# EAGLE schematic EEZ XMOS eval r1B4 (EAGLE 6.1)
Assembly variants: Farnell, TME

## Sheet 1 of 5
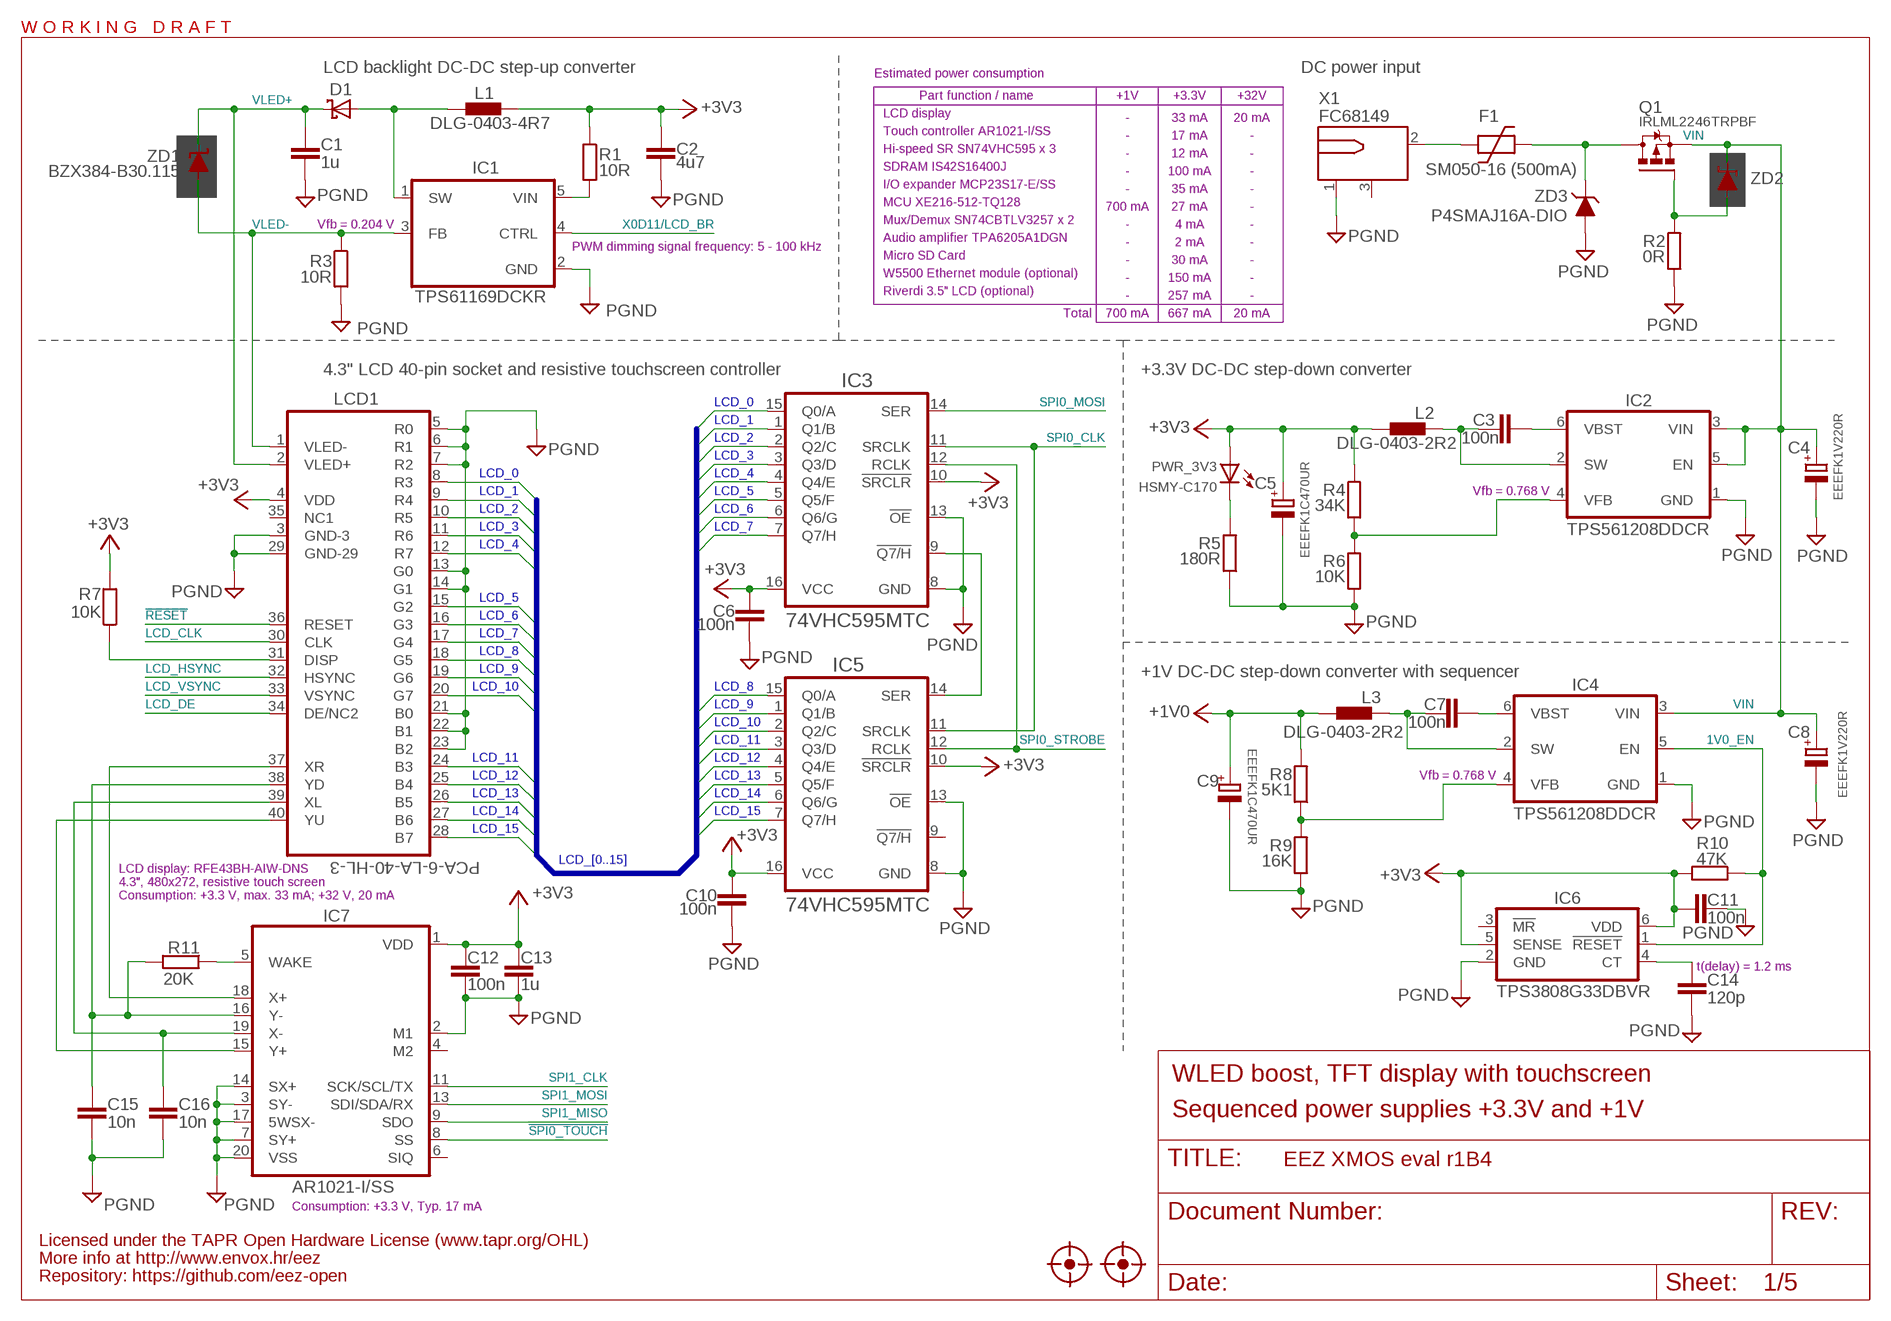
[diagram p0: schematic, sheet 1]

### Parts
C1  1u  C-EUC0805  [C0805]
C2  4u7  C-EUC1206  [C1206]
C3  100n  C-EUC0603  [C0603]
C4  EEEFK1V220R  EEE-FK1V100R-CASE-C  [CAPAE530X610N]
C5  EEEFK1C470UR  EEE-FK1V100R-CASE-C  [CAPAE530X610N]
C6  100n  C-EUC0603  [C0603]
C7  100n  C-EUC0603  [C0603]
C8  EEEFK1V220R  EEE-FK1V100R-CASE-C  [CAPAE530X610N]
C9  EEEFK1C470UR  EEE-FK1V100R-CASE-C  [CAPAE530X610N]
C10  100n  C-EUC0603  [C0603]
C11  100n  C-EUC0603  [C0603]
C12  100n  C-EUC0603  [C0603]
C13  1u  C-EUC0805  [C0805]
C14  120p  C-EUC0805  [C0805]
C15  10n  C-EUC0805  [C0805]
C16  10n  C-EUC0805  [C0805]
D1  SCHOTTKYSOD123  [SOD123]
F1  SM050-16 (500mA)  FUSE_RESETTABLE21210  [F1210]
FM1  FIDUCIAL_2  [FIDUCIAL_DUAL]
FM2  FIDUCIAL_2  [FIDUCIAL_DUAL]
IC1  TPS61169DCKR  [DCK0005A_N]
IC2  TPS561208DDCR  TPS56120X  [DBV6]
IC3  74VHC595MTC  SN74HC595TSSOP  [PW(R-PDSO-G16)]
IC4  TPS561208DDCR  TPS56120X  [DBV6]
IC5  74VHC595MTC  SN74HC595TSSOP  [PW(R-PDSO-G16)]
IC6  TPS3808G33DBVR  TPS3808  [DBV6]
IC7  AR1021-I/SS  [SOP65P780X200-20N]
L1  DLG-0403-4R7  DE0403  [DE0403]
L2  DLG-0403-2R2  DE0403  [DE0403]
L3  DLG-0403-2R2  DE0403  [DE0403]
LCD1  PCA-6-LA-40-HL-3  RFE430Y-AIW-DNS  [FPC_40]
PWR_3V3  HSMY-C170  LED0805  [LED_0805]
Q1  IRLML2246TRPBF  [SOT95P237X112-3N]
R1  10R  R-EU_R1206  [R1206]
R2  0R  R-EU_R0805  [R0805]
R3  10R  R-EU_R1206  [R1206]
R4  34K  R-EU_R0805  [R0805]
R5  180R  R-EU_R0805  [R0805]
R6  10K  R-EU_R0805  [R0805]
R7  10K  R-EU_R0805  [R0805]
R8  5K1  R-EU_R0805  [R0805]
R9  16K  R-EU_R0805  [R0805]
R10  47K  R-EU_R0805  [R0805]
R11  20K  R-EU_R0805  [R0805]
X1  FC68149  DC21_PWRX  [DC-21MM]
ZD1  BZX384-B30.115  ZENER-DIODESOD323  [SOD323-W]
ZD2  ZENER-DIODESOD323  [SOD323-W]
ZD3  P4SMAJ16A-DIO  PSMAXX  [DO214AC]

### Nets
1V0_EN: IC4.5(EN) IC6.1(!RESET) R10.1
!RESET: LCD1.36(RESET) ; also sheet 2,3,5
!SPI0_TOUCH: IC7.8(SS) ; also sheet 3
+1V0: C9.1 L3.2 R8.2 ; also sheet 2,3
+1V0_SW: C7.1 IC4.2(SW) L3.1
+3V3: C2.1 C5.1 C6.2 C10.2 C11.2 C12.2 C13.2 IC3.10(!SRCLR) IC3.16(VCC) IC5.10(!SRCLR) IC5.16(VCC) IC6.5(SENSE) IC6.6(VDD) IC7.1(VDD) L1.1 L2.2 LCD1.4(VDD) PWR_3V3.A R1.1 R4.2 R7.2 R10.2 ; also sheet 2,3,4,5
+3V3_SW: C3.1 IC2.2(SW) L2.1
GND [gnd]: C1.2 C2.2 C4.2 C5.2 C6.1 C8.2 C9.2 C10.1 C11.1 C12.1 C13.1 C14.2 C15.2 C16.2 IC1.2(GND) IC2.1(GND) IC3.8(GND) IC3.13(!OE) IC4.1(GND) IC5.8(GND) IC5.13(!OE) IC6.2(GND) IC7.2(M1) IC7.3(SY-) IC7.7(SY+) IC7.14(SX+) IC7.17(5WSX-) IC7.20(VSS) LCD1.3(GND-3) LCD1.5(R0) LCD1.6(R1) LCD1.7(R2) LCD1.13(G0) LCD1.14(G1) LCD1.21(B0) LCD1.22(B1) LCD1.23(B2) LCD1.29(GND-29) R2.1 R3.2 R5.1 R6.1 R9.1 X1.1 ZD3.A ; supply symbol labelled PGND ; also sheet 2,3,4,5
LCD_0: IC3.15(Q0/A) LCD1.8(R3)
LCD_1: IC3.1(Q1/B) LCD1.9(R4)
LCD_2: IC3.2(Q2/C) LCD1.10(R5)
LCD_3: IC3.3(Q3/D) LCD1.11(R6)
LCD_4: IC3.4(Q4/E) LCD1.12(R7)
LCD_5: IC3.5(Q5/F) LCD1.15(G2)
LCD_6: IC3.6(Q6/G) LCD1.16(G3)
LCD_7: IC3.7(Q7/H) LCD1.17(G4)
LCD_8: IC5.15(Q0/A) LCD1.18(G5)
LCD_9: IC5.1(Q1/B) LCD1.19(G6)
LCD_10: IC5.2(Q2/C) LCD1.20(G7)
LCD_11: IC5.3(Q3/D) LCD1.24(B3)
LCD_12: IC5.4(Q4/E) LCD1.25(B4)
LCD_13: IC5.5(Q5/F) LCD1.26(B5)
LCD_14: IC5.6(Q6/G) LCD1.27(B6)
LCD_15: IC5.7(Q7/H) LCD1.28(B7)
LCD_CLK: LCD1.30(CLK) ; also sheet 3
LCD_DE: LCD1.34(DE/NC2) ; also sheet 3
LCD_HSYNC: LCD1.32(HSYNC) ; also sheet 3
LCD_VSYNC: LCD1.33(VSYNC) ; also sheet 3
N$1: PWR_3V3.C R5.2
N$2: IC7.15(Y+) LCD1.40(YU)
N$3: C16.1 IC7.19(X-) LCD1.39(XL)
N$4: C15.1 IC7.16(Y-) LCD1.38(YD) R11.2
N$5: IC7.18(X+) LCD1.37(XR)
N$7: Q1.1(G) R2.2 ZD2.A
N$8: IC7.5(WAKE) R11.1
N$15: F1.1 X1.2
N$28: IC2.4(VFB) R4.1 R6.2
N$30: IC1.5(VIN) R1.2
N$33: C3.2 IC2.6(VBST)
N$40: IC3.9(!Q7/H) IC5.14(SER)
N$46: IC4.4(VFB) R8.1 R9.2
N$49: C7.2 IC4.6(VBST)
N$63: C14.1 IC6.4(CT)
N$79: LCD1.31(DISP) R7.1
PMOS_D: F1.2 Q1.3(D) ZD3.C
SPI0_CLK: IC3.11(SRCLK) IC5.11(SRCLK) ; also sheet 3
SPI0_MOSI: IC3.14(SER) ; also sheet 3
SPI0_STROBE: IC3.12(RCLK) IC5.12(RCLK) ; also sheet 3
SPI1_CLK: IC7.11(SCK/SCL/TX) ; also sheet 3,5
SPI1_MISO: IC7.9(SDO) ; also sheet 3,5
SPI1_MOSI: IC7.13(SDI/SDA/RX) ; also sheet 3,5
SW_WLED: D1.A IC1.1(SW) L1.2
VIN: C4.1 C8.1 IC2.3(VIN) IC2.5(EN) IC4.3(VIN) Q1.2(S) ZD2.C ; also sheet 3
VLED+: C1.1 D1.C LCD1.2(VLED+) ZD1.C
VLED-: IC1.3(FB) LCD1.1(VLED-) R3.1 ZD1.A
X0D11/LCD_BR: IC1.4(CTRL) ; also sheet 2,3
Unconnected: IC5.9(!Q7/H) IC6.3(!MR) IC7.4(M2) IC7.6(SIQ) LCD1.35(NC1)

### Buses
LCD_[0..15]

### Notes on the sheet
- W O R K I N G   D R A F T
- LCD backlight DC-DC step-up converter | DC power input
- Estimated power consumption
- Part function / name | +1V | +3.3V | +32V
- LCD display | - | 33 mA | 20 mA
- Touch controller AR1021-I/SS | - | 17 mA | -
- Hi-speed SR SN74VHC595 x 3 | - | 12 mA | -
- SDRAM IS42S16400J | - | 100 mA | -
- I/O expander MCP23S17-E/SS | - | 35 mA | -
- MCU XE216-512-TQ128 | 700 mA | 27 mA | -
- Mux/Demux SN74CBTLV3257 x 2 | - | 4 mA | -
- Vfb = 0.204 V
- Audio amplifier TPA6205A1DGN | - | 2 mA | -
- PWM dimming signal frequency: 5 - 100 kHz
- Micro SD Card | - | 30 mA | -
- W5500 Ethernet module (optional) | - | 150 mA | -
- Riverdi 3.5" LCD (optional) | - | 257 mA | -
- 700 mA | 667 mA | 20 mA
- Total
- 4.3" LCD 40-pin socket and resistive touchscreen controller | +3.3V DC-DC step-down converter
- Vfb = 0.768 V
- +1V DC-DC step-down converter with sequencer
- Vfb = 0.768 V
- LCD display: RFE43BH-AIW-DNS
- 4.3", 480x272, resistive touch screen
- Consumption: +3.3 V, max. 33 mA; +32 V, 20 mA
- t(delay) = 1.2 ms
- WLED boost, TFT display with touchscreen
- Sequenced power supplies +3.3V and +1V
- Consumption: +3.3 V, Typ. 17 mA
- Licensed under the TAPR Open Hardware License (www.tapr.org/OHL)
- More info at http://www.envox.hr/eez
- Repository: https://github.com/eez-open

## Sheet 2 of 5
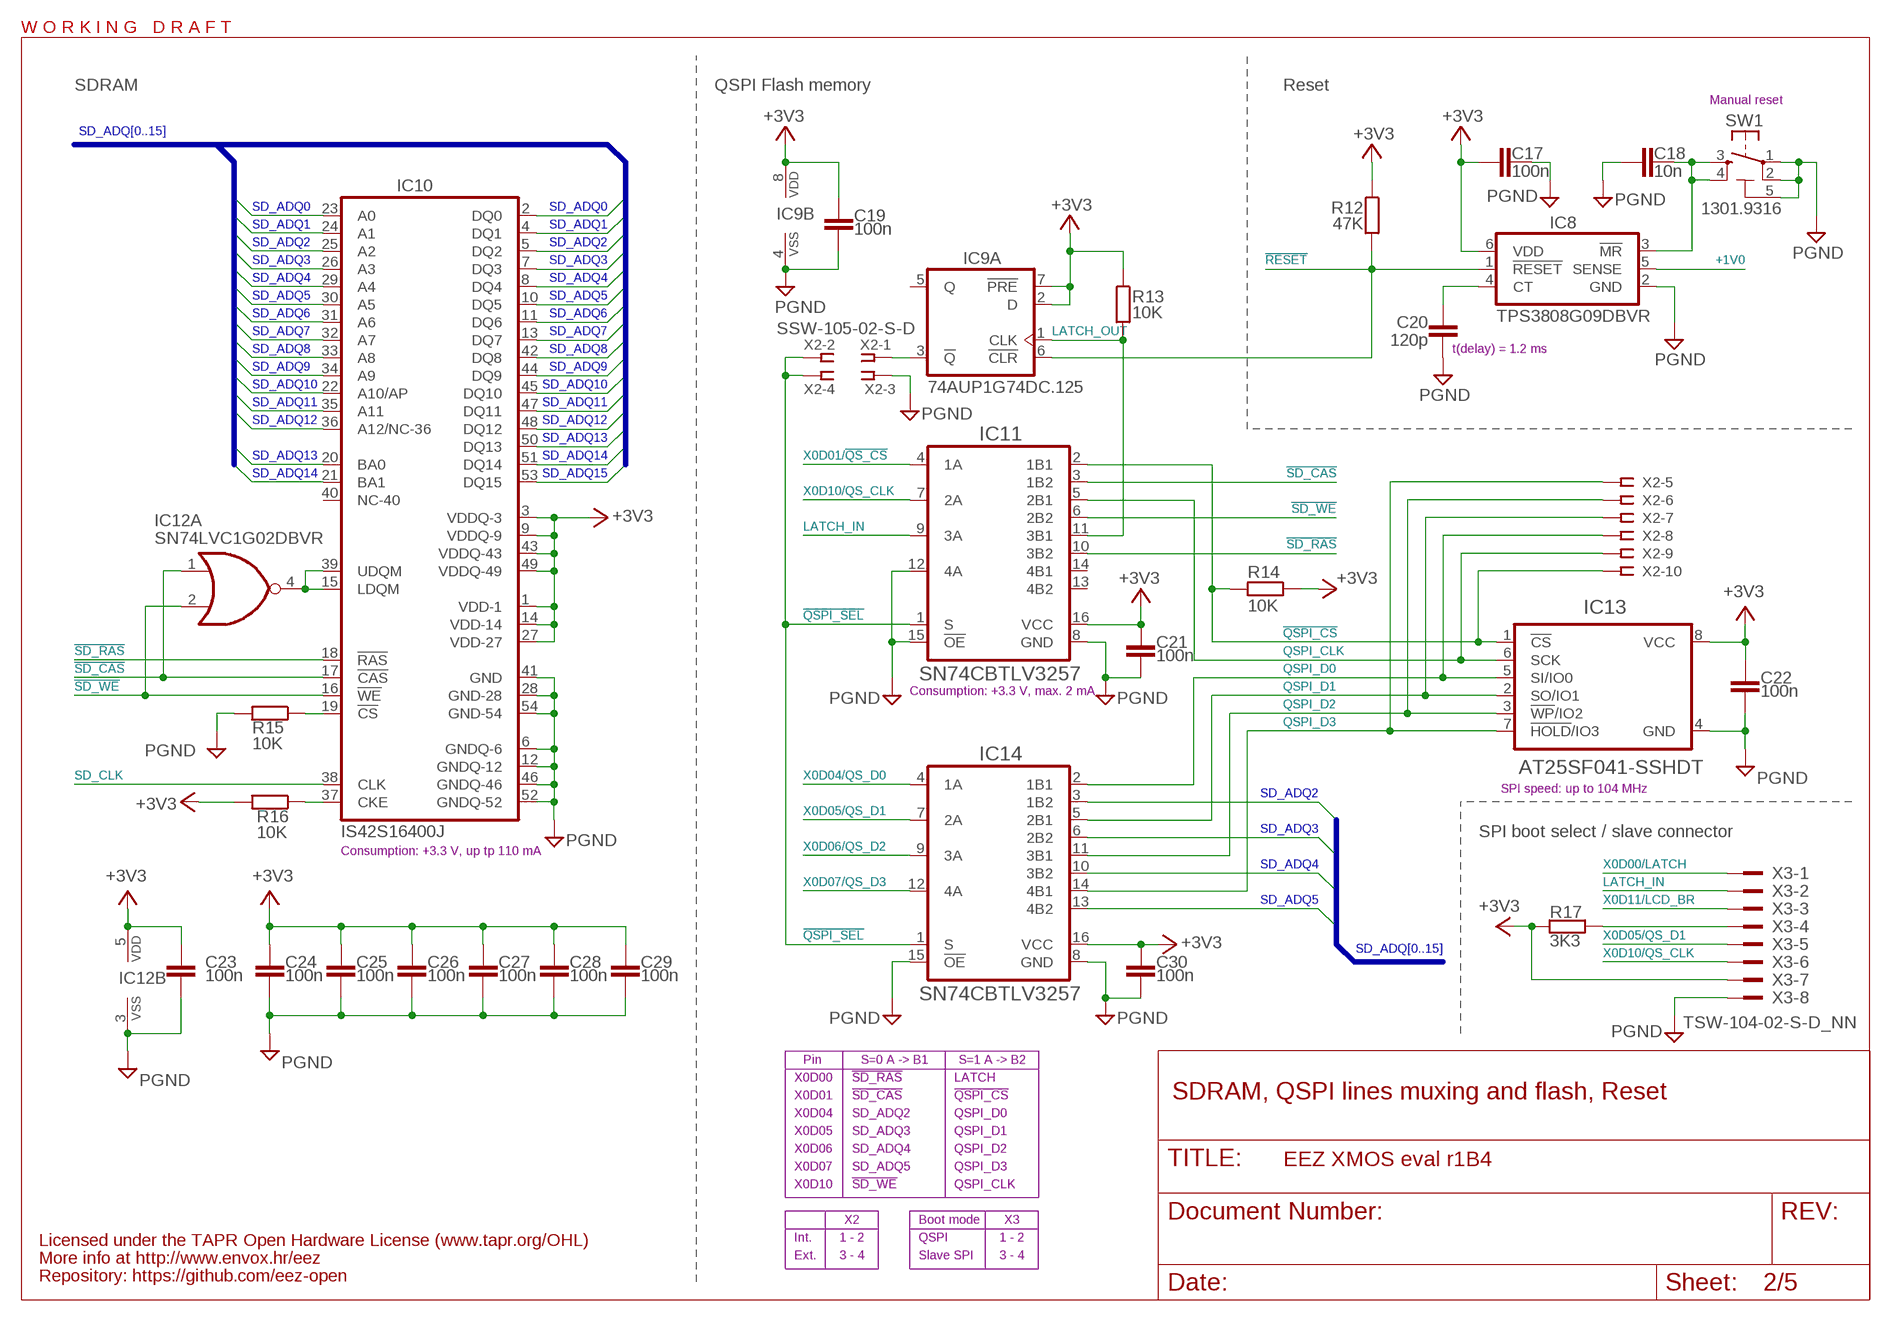
[diagram p1: schematic, sheet 2]

### Parts
C17  100n  C-EUC0603  [C0603]
C18  10n  C-EUC0805  [C0805]
C19  100n  C-EUC0603  [C0603]
C20  120p  C-EUC0805  [C0805]
C21  100n  C-EUC0603  [C0603]
C22  100n  C-EUC0603  [C0603]
C23  100n  C-EUC0603  [C0603]
C24  100n  C-EUC0603  [C0603]
C25  100n  C-EUC0603  [C0603]
C26  100n  C-EUC0603  [C0603]
C27  100n  C-EUC0603  [C0603]
C28  100n  C-EUC0603  [C0603]
C29  100n  C-EUC0603  [C0603]
C30  100n  C-EUC0603  [C0603]
IC8  TPS3808G09DBVR  TPS3808  [DBV6]
IC9  74AUP1G74DC.125  SN74LVC1G74DCTR-VSSOP  [DCU8]
IC10  IS42S16400J  IS42S16400  [TSOPII-54]
IC11  SN74CBTLV3257  [PW(R-PDSO-G16)]
IC12  SN74LVC1G02DBVR  [DBV5]
IC13  AT25SF041-SSHDT  AT25SFXXX  [SOIC127P600X175-8N]
IC14  SN74CBTLV3257  [PW(R-PDSO-G16)]
R12  47K  R-EU_R0805  [R0805]
R13  10K  R-EU_R1206  [R1206]
R14  10K  R-EU_R0805  [R0805]
R15  10K  R-EU_R0805  [R0805]
R16  10K  R-EU_R0805  [R0805]
R17  3K3  R-EU_R0805  [R0805]
SW1  1301.9316  TACT_SW  [TACTM-6XN]
X2  SSW-105-02-S-D  [SSW-105-02-S-D]
X3  TSW-104-02-S-D_NN  [TSW-104-02-S-D-NONUM]

### Nets
!QSPI_CS: IC11.2(1B1) IC13.1(!CS) R14.2 X2.10
!QSPI_SEL: IC11.1(S) IC14.1(S) X2.2 X2.4
!RESET: IC8.1(!RESET) IC9.6(A:!CLR) R12.2 ; also sheet 1,3,5
!SD_CAS: IC10.17(!CAS) IC11.3(1B2) IC12.1(A:A)
!SD_RAS: IC10.18(!RAS) IC11.10(3B2)
!SD_WE: IC10.16(!WE) IC11.6(2B2) IC12.2(A:B)
+1V0: IC8.5(SENSE) ; also sheet 1,3
+3V3: C17.1 C19.1 C21.1 C22.1 C23.1 C24.1 C25.1 C26.1 C27.1 C28.1 C29.1 C30.1 IC8.6(VDD) IC9.2(A:D) IC9.7(A:!PRE) IC9.8(B:VDD) IC10.1(VDD-1) IC10.3(VDDQ-3) IC10.9(VDDQ-9) IC10.14(VDD-14) IC10.27(VDD-27) IC10.43(VDDQ-43) IC10.49(VDDQ-49) IC11.16(VCC) IC12.5(B:VDD) IC13.8(VCC) IC14.16(VCC) R12.1 R13.1 R14.1 R16.2 R17.2 X3.7 ; also sheet 1,3,4,5
GND [gnd]: C17.2 C18.1 C19.2 C20.2 C21.2 C22.2 C23.2 C24.2 C25.2 C26.2 C27.2 C28.2 C29.2 C30.2 IC8.2(GND) IC9.4(B:VSS) IC10.6(GNDQ-6) IC10.12(GNDQ-12) IC10.28(GND-28) IC10.41(GND) IC10.46(GNDQ-46) IC10.52(GNDQ-52) IC10.54(GND-54) IC11.8(GND) IC11.12(4A) IC11.15(!OE) IC12.3(B:VSS) IC13.4(GND) IC14.8(GND) IC14.15(!OE) R15.2 SW1.1 SW1.2 SW1.5(5-GND) X2.3 X3.8 ; supply symbol labelled PGND ; also sheet 1,3,4,5
LATCH_IN: IC11.9(3A) X3.2
LATCH_OUT: IC9.1(A:CLK) IC11.11(3B1) R13.2
N$14: R17.1 X3.4
N$20: IC10.19(!CS) R15.1
N$21: IC10.15(LDQM) IC10.39(UDQM) IC12.4(A:Y)
N$22: IC10.37(CKE) R16.1
N$31: C20.1 IC8.4(CT)
N$32: C18.2 IC8.3(!MR) SW1.3 SW1.4
N$35: IC9.3(A:!Q) X2.1
QSPI_CLK: IC11.5(2B1) IC13.6(SCK) X2.9
QSPI_D0: IC13.5(SI/IO0) IC14.2(1B1) X2.8
QSPI_D1: IC13.2(SO/IO1) IC14.5(2B1) X2.7
QSPI_D2: IC13.3(!WP!/IO2) IC14.11(3B1) X2.6
QSPI_D3: IC13.7(!HOLD!/IO3) IC14.14(4B1) X2.5
SD_ADQ0: IC10.2(DQ0) IC10.23(A0) ; also sheet 3
SD_ADQ1: IC10.4(DQ1) IC10.24(A1) ; also sheet 3
SD_ADQ2: IC10.5(DQ2) IC10.25(A2) IC14.3(1B2)
SD_ADQ3: IC10.7(DQ3) IC10.26(A3) IC14.6(2B2)
SD_ADQ4: IC10.8(DQ4) IC10.29(A4) IC14.10(3B2)
SD_ADQ5: IC10.10(DQ5) IC10.30(A5) IC14.13(4B2)
SD_ADQ6: IC10.11(DQ6) IC10.31(A6) ; also sheet 3
SD_ADQ7: IC10.13(DQ7) IC10.32(A7) ; also sheet 3
SD_ADQ8: IC10.33(A8) IC10.42(DQ8) ; also sheet 3
SD_ADQ9: IC10.34(A9) IC10.44(DQ9) ; also sheet 3
SD_ADQ10: IC10.22(A10/AP) IC10.45(DQ10) ; also sheet 3
SD_ADQ11: IC10.35(A11) IC10.47(DQ11) ; also sheet 3
SD_ADQ12: IC10.36(A12/NC-36) IC10.48(DQ12) ; also sheet 3
SD_ADQ13: IC10.20(BA0) IC10.50(DQ13) ; also sheet 3
SD_ADQ14: IC10.21(BA1) IC10.51(DQ14) ; also sheet 3
SD_ADQ15: IC10.53(DQ15) ; also sheet 3
SD_CLK: IC10.38(CLK) ; also sheet 3
X0D00/LATCH: X3.1 ; also sheet 3
X0D01/!QS_CS: IC11.4(1A) ; also sheet 3
X0D04/QS_D0: IC14.4(1A) ; also sheet 3
X0D05/QS_D1: IC14.7(2A) X3.5 ; also sheet 3
X0D06/QS_D2: IC14.9(3A) ; also sheet 3
X0D07/QS_D3: IC14.12(4A) ; also sheet 3
X0D10/QS_CLK: IC11.7(2A) X3.6 ; also sheet 3
X0D11/LCD_BR: X3.3 ; also sheet 1,3
Unconnected: IC9.5(A:Q) IC10.40(NC-40) IC11.13(4B2) IC11.14(4B1)

### Buses
SD_ADQ[0..15]

### Notes on the sheet
- W O R K I N G   D R A F T
- SDRAM | QSPI Flash memory | Reset
- Manual reset
- t(delay) = 1.2 ms
- Consumption: +3.3 V, max. 2 mA
- SPI speed: up to 104 MHz
- SPI boot select / slave connector
- Consumption: +3.3 V, up tp 110 mA
- Pin | S=0 A -> B1 | S=1 A -> B2
- X0D00 | !SD_RAS | LATCH
- X0D01 | !SD_CAS | !QSPI_CS | SDRAM, QSPI lines muxing and flash, Reset
- X0D04 | SD_ADQ2 | QSPI_D0
- X0D05 | SD_ADQ3 | QSPI_D1
- X0D06 | SD_ADQ4 | QSPI_D2
- X0D07 | SD_ADQ5 | QSPI_D3
- X0D10 | !SD_WE | QSPI_CLK
- X2 | Boot mode | X3
- Int. | 1 - 2 | QSPI | 1 - 2
- Licensed under the TAPR Open Hardware License (www.tapr.org/OHL)
- Ext. | 3 - 4 | Slave SPI | 3 - 4
- More info at http://www.envox.hr/eez
- Repository: https://github.com/eez-open

## Sheet 3 of 5
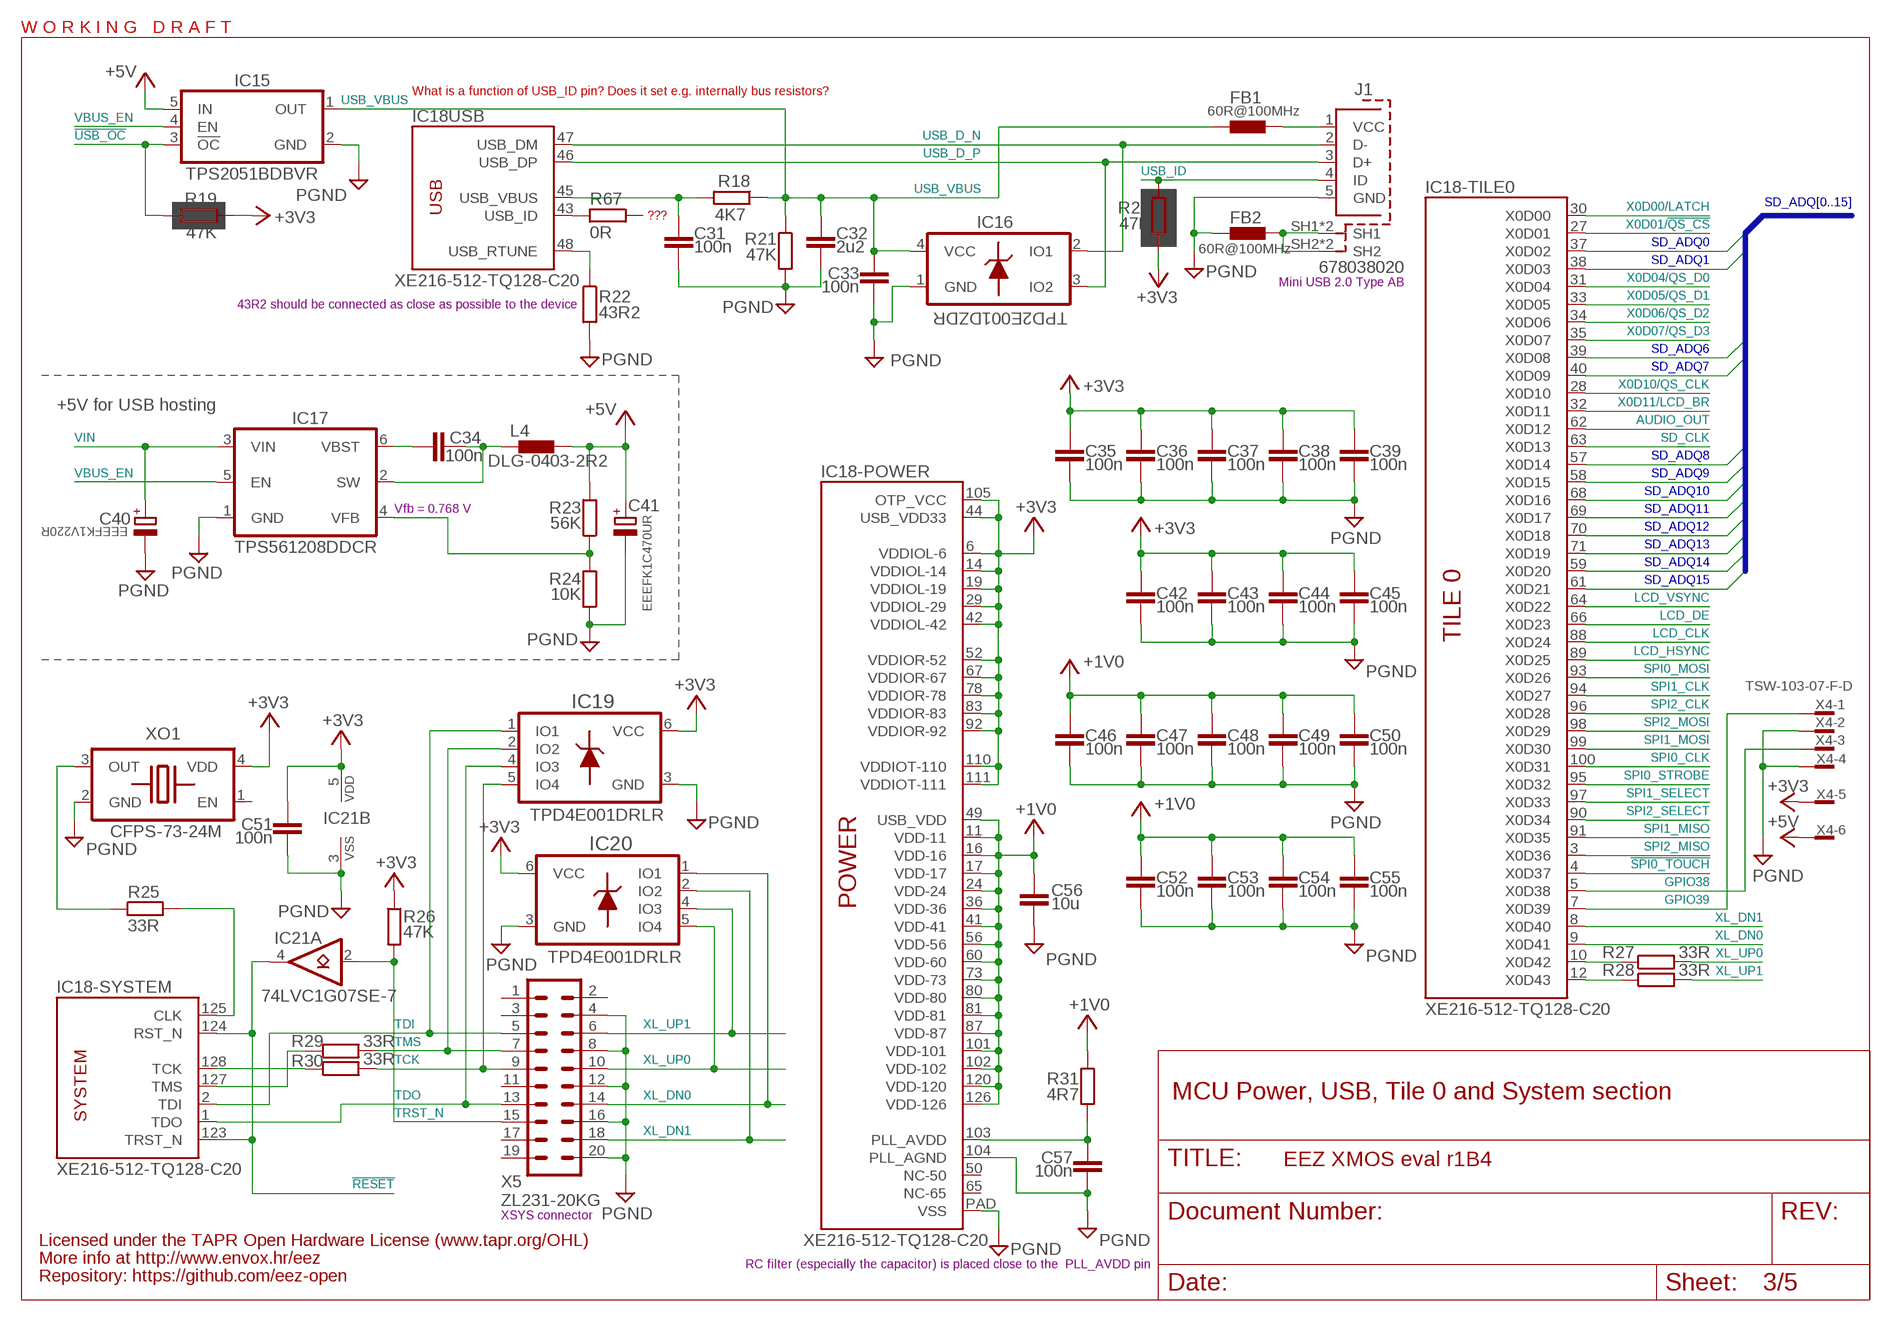
[diagram p2: schematic, sheet 3]

### Parts
C31  100n  C-EUC0603  [C0603]
C32  2u2  C-EUC0805  [C0805]
C33  100n  C-EUC0603  [C0603]
C34  100n  C-EUC0603  [C0603]
C35  100n  C-EUC0603  [C0603]
C36  100n  C-EUC0603  [C0603]
C37  100n  C-EUC0603  [C0603]
C38  100n  C-EUC0603  [C0603]
C39  100n  C-EUC0603  [C0603]
C40  EEEFK1V220R  EEE-FK1V100R-CASE-C  [CAPAE530X610N]
C41  EEEFK1C470UR  EEE-FK1V100R-CASE-C  [CAPAE530X610N]
C42  100n  C-EUC0603  [C0603]
C43  100n  C-EUC0603  [C0603]
C44  100n  C-EUC0603  [C0603]
C45  100n  C-EUC0603  [C0603]
C46  100n  C-EUC0603  [C0603]
C47  100n  C-EUC0603  [C0603]
C48  100n  C-EUC0603  [C0603]
C49  100n  C-EUC0603  [C0603]
C50  100n  C-EUC0603  [C0603]
C51  100n  C-EUC0603  [C0603]
C52  100n  C-EUC0603  [C0603]
C53  100n  C-EUC0603  [C0603]
C54  100n  C-EUC0603  [C0603]
C55  100n  C-EUC0603  [C0603]
C56  10u  C-EUC1210  [C1210]
C57  100n  C-EUC0603  [C0603]
FB1  60R@100MHz  FERRITE_BEAD0603  [BEAD0603]
FB2  60R@100MHz  FERRITE_BEAD0603  [BEAD0603]
IC15  TPS2051BDBVR  TPS2051B  [DBV5]
IC16  TPD2E001DZDR  [SOP192P292X122-4N]
IC17  TPS561208DDCR  TPS56120X  [DBV6]
IC18  XE216-512-TQ128-C20  XE216-TQ128  [TQ128]
IC19  TPD4E001DRLR  TPD4E001-DRL  [DRL6]
IC20  TPD4E001DRLR  TPD4E001-DRL  [DRL6]
IC21  74LVC1G07SE-7  SN74LVC1G07-SC70  [DCK5]
J1  678038020  [678038020]
L4  DLG-0403-2R2  DE0403  [DE0403]
R18  4K7  R-EU_R0805  [R0805]
R19  47K  R-EU_R0805  [R0805]
R20  47K  R-EU_R0805  [R0805]
R21  47K  R-EU_R0805  [R0805]
R22  43R2  R-EU_R0805  [R0805]
R23  56K  R-EU_R0805  [R0805]
R24  10K  R-EU_R0805  [R0805]
R25  33R  R-EU_R0603  [R0603]
R26  47K  R-EU_R0805  [R0805]
R27  33R  R-EU_R0603  [R0603]
R28  33R  R-EU_R0603  [R0603]
R29  33R  R-EU_R0603  [R0603]
R30  33R  R-EU_R0603  [R0603]
R31  4R7  R-EU_R0805  [R0805]
R67  0R  R-EU_R0805  [R0805]
X4  TSW-103-07-F-D  [TSW-103-07-F-D]
X5  ZL231-20KG  ML20L  [ML20L]
XO1  CFPS-73-24M  XO-7X5MM  [12SMX(C)]

### Nets
!RESET: IC18.123(-SYSTEM:TRST_N) IC18.124(-SYSTEM:RST_N) IC21.4(A:Y) ; also sheet 1,2,5
!SPI0_TOUCH: IC18.4(-TILE0:X0D37) ; also sheet 1
!USB_OC: IC15.3(!OC) R19.1 ; also sheet 5
+1V0: C46.1 C47.1 C48.1 C49.1 C50.1 C52.1 C53.1 C54.1 C55.1 C56.1 IC18.11(-POWER:VDD-11) IC18.16(-POWER:VDD-16) IC18.17(-POWER:VDD-17) IC18.24(-POWER:VDD-24) IC18.36(-POWER:VDD-36) IC18.41(-POWER:VDD-41) IC18.49(-POWER:USB_VDD) IC18.56(-POWER:VDD-56) IC18.60(-POWER:VDD-60) IC18.73(-POWER:VDD-73) IC18.80(-POWER:VDD-80) IC18.81(-POWER:VDD-81) IC18.87(-POWER:VDD-87) IC18.101(-POWER:VDD-101) IC18.102(-POWER:VDD-102) IC18.120(-POWER:VDD-120) IC18.126(-POWER:VDD-126) R31.1 ; also sheet 1,2
+3V3: C35.1 C36.1 C37.1 C38.1 C39.1 C42.1 C43.1 C44.1 C45.1 C51.1 IC18.6(-POWER:VDDIOL-6) IC18.14(-POWER:VDDIOL-14) IC18.19(-POWER:VDDIOL-19) IC18.29(-POWER:VDDIOL-29) IC18.42(-POWER:VDDIOL-42) IC18.44(-POWER:USB_VDD33) IC18.52(-POWER:VDDIOR-52) IC18.67(-POWER:VDDIOR-67) IC18.78(-POWER:VDDIOR-78) IC18.83(-POWER:VDDIOR-83) IC18.92(-POWER:VDDIOR-92) IC18.105(-POWER:OTP_VCC) IC18.110(-POWER:VDDIOT-110) IC18.111(-POWER:VDDIOT-111) IC19.6(VCC) IC20.6(VCC) IC21.5(B:VDD) R19.2 R20.1 R26.1 X4.5 XO1.4(VDD) ; also sheet 1,2,4,5
+5V: C41.1 IC15.5(IN) L4.2 R23.2 X4.6
+5V_SW: C34.1 IC17.2(SW) L4.1
AUDIO_OUT: IC18.62(-TILE0:X0D12) ; also sheet 4,5
GND [gnd]: C31.2 C32.2 C33.1 C35.2 C36.2 C37.2 C38.2 C39.2 C40.2 C41.2 C42.2 C43.2 C44.2 C45.2 C46.2 C47.2 C48.2 C49.2 C50.2 C51.2 C52.2 C53.2 C54.2 C55.2 C56.2 C57.2 FB2.P$1 IC15.2(GND) IC16.1(GND) IC17.1(GND) IC18.104(-POWER:PLL_AGND) IC18.PAD(-POWER:VSS) IC19.3(GND) IC20.3(GND) IC21.3(B:VSS) J1.5(GND) R21.2 R22.2 R24.1 X4.2 X4.4 X5.4 X5.8 X5.12 X5.16 X5.20 XO1.2(GND) ; supply symbol labelled PGND ; also sheet 1,2,4,5
GPIO38: IC18.5(-TILE0:X0D38) X4.3
GPIO39: IC18.7(-TILE0:X0D39) X4.1
LCD_CLK: IC18.88(-TILE0:X0D24) ; also sheet 1
LCD_DE: IC18.66(-TILE0:X0D23) ; also sheet 1
LCD_HSYNC: IC18.89(-TILE0:X0D25) ; also sheet 1
LCD_VSYNC: IC18.64(-TILE0:X0D22) ; also sheet 1
N$10: IC18.10(-TILE0:X0D42) R27.1
N$11: IC18.12(-TILE0:X0D43) R28.1
N$12: IC18.125(-SYSTEM:CLK) R25.2
N$18: IC18.43(USB:USB_ID) R67.1
N$36: C57.1 IC18.103(-POWER:PLL_AVDD) R31.2
N$37: FB2.P$2 J1.SH1 J1.SH1.1(SH1) J1.SH2 J1.SH2.2(SH2)
N$41: IC18.48(USB:USB_RTUNE) R22.1
N$43: C31.1 IC18.45(USB:USB_VBUS) R18.2
N$48: IC18.127(-SYSTEM:TMS) R29.1
N$52: IC18.128(-SYSTEM:TCK) R30.1
N$71: IC17.4(VFB) R23.1 R24.2
N$72: FB1.P$2 J1.1(VCC)
N$74: C34.2 IC17.6(VBST)
N$78: R25.1 XO1.3(OUT)
SD_ADQ0: IC18.37(-TILE0:X0D02) ; also sheet 2
SD_ADQ1: IC18.38(-TILE0:X0D03) ; also sheet 2
SD_ADQ6: IC18.39(-TILE0:X0D08) ; also sheet 2
SD_ADQ7: IC18.40(-TILE0:X0D09) ; also sheet 2
SD_ADQ8: IC18.57(-TILE0:X0D14) ; also sheet 2
SD_ADQ9: IC18.58(-TILE0:X0D15) ; also sheet 2
SD_ADQ10: IC18.68(-TILE0:X0D16) ; also sheet 2
SD_ADQ11: IC18.69(-TILE0:X0D17) ; also sheet 2
SD_ADQ12: IC18.70(-TILE0:X0D18) ; also sheet 2
SD_ADQ13: IC18.71(-TILE0:X0D19) ; also sheet 2
SD_ADQ14: IC18.59(-TILE0:X0D20) ; also sheet 2
SD_ADQ15: IC18.61(-TILE0:X0D21) ; also sheet 2
SD_CLK: IC18.63(-TILE0:X0D13) ; also sheet 2
SPI0_CLK: IC18.100(-TILE0:X0D31) ; also sheet 1
SPI0_MOSI: IC18.93(-TILE0:X0D26) ; also sheet 1
SPI0_STROBE: IC18.95(-TILE0:X0D32) ; also sheet 1
SPI1_CLK: IC18.94(-TILE0:X0D27) ; also sheet 1,5
SPI1_MISO: IC18.91(-TILE0:X0D35) ; also sheet 1,5
SPI1_MOSI: IC18.99(-TILE0:X0D30) ; also sheet 1,5
SPI1_SELECT: IC18.97(-TILE0:X0D33) ; also sheet 5
SPI2_CLK: IC18.96(-TILE0:X0D28) ; also sheet 5
SPI2_MISO: IC18.3(-TILE0:X0D36) ; also sheet 5
SPI2_MOSI: IC18.98(-TILE0:X0D29) ; also sheet 5
SPI2_SELECT: IC18.90(-TILE0:X0D34) ; also sheet 5
TCK: IC19.5(IO4) R30.2 X5.9
TDI: IC18.2(-SYSTEM:TDI) IC19.1(IO1) X5.5
TDO: IC18.1(-SYSTEM:TDO) IC19.4(IO3) X5.13
TMS: IC19.2(IO2) R29.2 X5.7
TRST_N: IC21.2(A:A) R26.2 X5.15
USB_D_N: IC16.2(IO1) IC18.47(USB:USB_DM) J1.2(D-)
USB_D_P: IC16.3(IO2) IC18.46(USB:USB_DP) J1.3(D+)
USB_ID: J1.4(ID) R20.2 ; also sheet 5
USB_VBUS: C32.1 C33.2 FB1.P$1 IC15.1(OUT) IC16.4(VCC) R18.1 R21.1
VBUS_EN: IC15.4(EN) IC17.5(EN) ; also sheet 5
VIN: C40.1 IC17.3(VIN) ; also sheet 1
X0D00/LATCH: IC18.30(-TILE0:X0D00) ; also sheet 2
X0D01/!QS_CS: IC18.27(-TILE0:X0D01) ; also sheet 2
X0D04/QS_D0: IC18.31(-TILE0:X0D04) ; also sheet 2
X0D05/QS_D1: IC18.33(-TILE0:X0D05) ; also sheet 2
X0D06/QS_D2: IC18.34(-TILE0:X0D06) ; also sheet 2
X0D07/QS_D3: IC18.35(-TILE0:X0D07) ; also sheet 2
X0D10/QS_CLK: IC18.28(-TILE0:X0D10) ; also sheet 2
X0D11/LCD_BR: IC18.32(-TILE0:X0D11) ; also sheet 1,2
XL_DN0: IC18.9(-TILE0:X0D41) IC20.1(IO1) X5.14
XL_DN1: IC18.8(-TILE0:X0D40) IC20.2(IO2) X5.18
XL_UP0: IC20.5(IO4) R27.2 X5.10
XL_UP1: IC20.4(IO3) R28.2 X5.6
Unconnected: IC18.50(-POWER:NC-50) IC18.65(-POWER:NC-65) R67.2 X5.1 X5.2 X5.3 X5.11 X5.17 X5.19 XO1.1(EN)

### Buses
SD_ADQ[0..15]

### Notes on the sheet
- W O R K I N G   D R A F T
- What is a function of USB_ID pin? Does it set e.g. internally bus resistors?
- ???
- Mini USB 2.0 Type AB
- 43R2 should be connected as close as possible to the device
- +5V for USB hosting
- Vfb = 0.768 V
- MCU Power, USB, Tile 0 and System section
- XSYS connector
- Licensed under the TAPR Open Hardware License (www.tapr.org/OHL)
- More info at http://www.envox.hr/eez
- RC filter (especially the capacitor) is placed close to the  PLL_AVDD pin
- Repository: https://github.com/eez-open

## Sheet 4 of 5
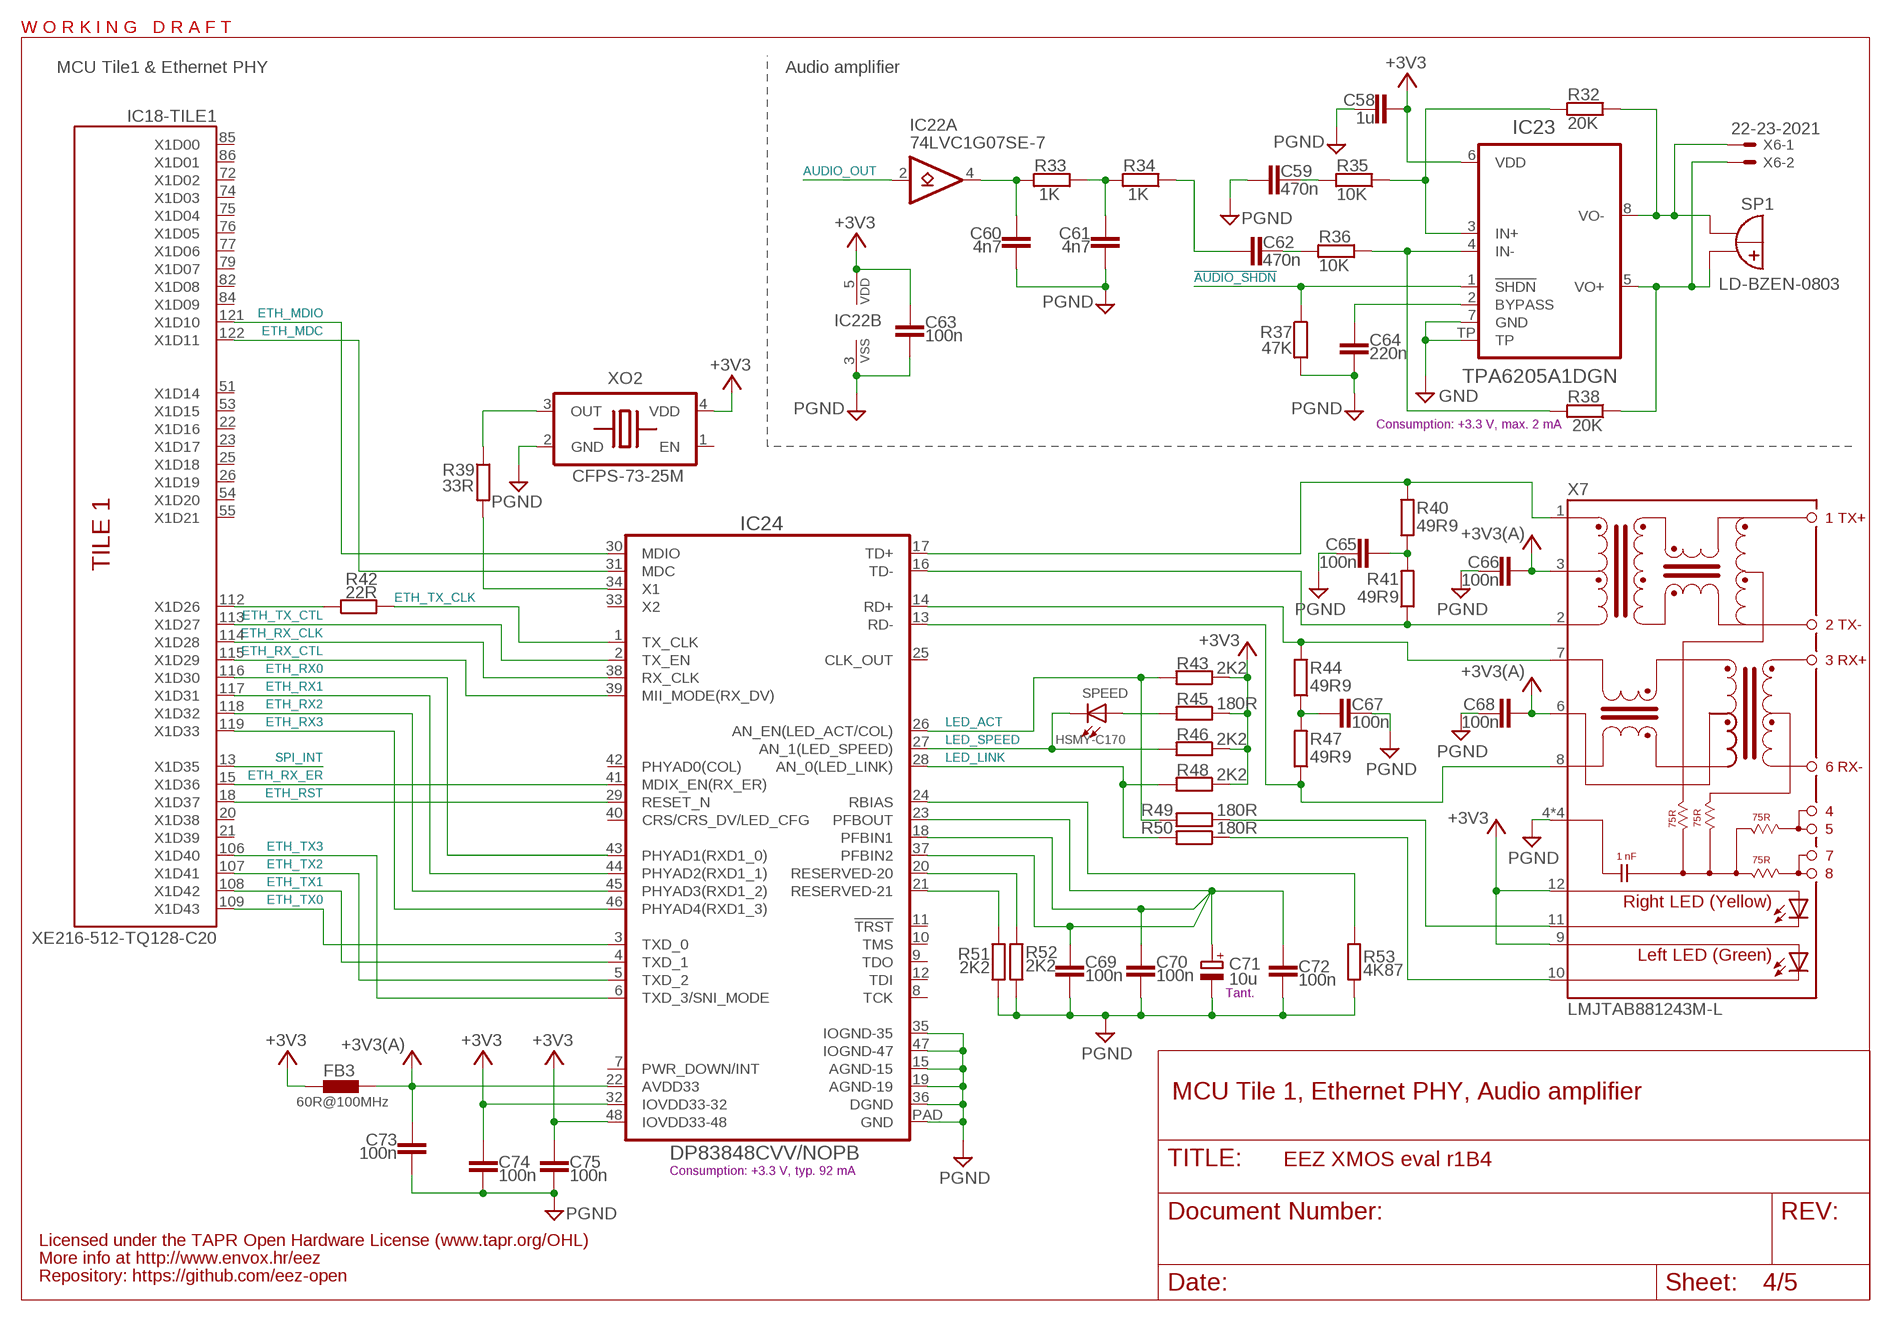
[diagram p3: schematic, sheet 4]

### Parts
C58  1u  C-EUC0805  [C0805]
C59  470n  C-EUC0805  [C0805]
C60  4n7  C-EUC0805  [C0805]
C61  4n7  C-EUC0805  [C0805]
C62  470n  C-EUC0805  [C0805]
C63  100n  C-EUC0603  [C0603]
C64  220n  C-EUC0805  [C0805]
C65  100n  C-EUC0603  [C0603]
C66  100n  C-EUC0603  [C0603]
C67  100n  C-EUC0603  [C0603]
C68  100n  C-EUC0603  [C0603]
C69  100n  C-EUC0603  [C0603]
C70  100n  C-EUC0603  [C0603]
C71  10u  ECAP1206  [EC1206]
C72  100n  C-EUC0603  [C0603]
C73  100n  C-EUC0603  [C0603]
C74  100n  C-EUC0603  [C0603]
C75  100n  C-EUC0603  [C0603]
FB3  60R@100MHz  FERRITE_BEAD0603  [BEAD0603]
IC22  74LVC1G07SE-7  SN74LVC1G07-SC70  [DCK5]
IC23  TPA6205A1DGN  TPA6205  [SOP65P490X110-9N]
IC24  DP83848CVV/NOPB  DP83848  [PT48+PAD]
R32  20K  R-EU_R0805  [R0805]
R33  1K  R-EU_R0805  [R0805]
R34  1K  R-EU_R0805  [R0805]
R35  10K  R-EU_R0805  [R0805]
R36  10K  R-EU_R0805  [R0805]
R37  47K  R-EU_R0805  [R0805]
R38  20K  R-EU_R0805  [R0805]
R39  33R  R-EU_R0603  [R0603]
R40  49R9  R-EU_R0805  [R0805]
R41  49R9  R-EU_R0805  [R0805]
R42  22R  R-EU_R0805  [R0805]
R43  2K2  R-EU_R0805  [R0805]
R44  49R9  R-EU_R0805  [R0805]
R45  180R  R-EU_R0805  [R0805]
R46  2K2  R-EU_R0805  [R0805]
R47  49R9  R-EU_R0805  [R0805]
R48  2K2  R-EU_R0805  [R0805]
R49  180R  R-EU_R0805  [R0805]
R50  180R  R-EU_R0805  [R0805]
R51  2K2  R-EU_R0805  [R0805]
R52  2K2  R-EU_R0805  [R0805]
R53  4K87  R-EU_R0603  [R0603]
SP1  LD-BZEN-0803  BUZZER-0803  [LD-BZEN-0803]
SPEED  HSMY-C170  LED0805  [LED_0805]
X6  22-23-2021  [22-23-2021]
X7  LMJTAB881243M-L  RJ45-TRAFO-LED  [RJ45-TRAFO-LED]
XO2  CFPS-73-25M  XO-7X5MM  [12SMX(C)]

### Nets
!AUDIO_SHDN: IC23.1(!SHDN) R37.1 ; also sheet 5
+3V3: C58.2 C63.2 C74.1 C75.1 FB3.P$1 IC22.5(B:VDD) IC23.6(VDD) IC24.32(IOVDD33-32) IC24.48(IOVDD33-48) R43.1 R45.1 R46.1 R48.1 X7.9(GREEN-A) X7.12(YELLOW_A) XO2.4(VDD) ; also sheet 1,2,3,5
+3V3(A): C66.2 C68.2 C73.1 FB3.P$2 IC24.22(AVDD33) X7.3(CT) X7.6(CR)
AUDIO_OUT: IC22.2(A:A) ; also sheet 3,5
ETH_MDC: IC18.122(-TILE1:X1D11) IC24.31(MDC)
ETH_MDIO: IC18.121(-TILE1:X1D10) IC24.30(MDIO)
ETH_RST: IC18.18(-TILE1:X1D37) IC24.29(RESET_N) ; also sheet 5
ETH_RX0: IC18.116(-TILE1:X1D30) IC24.43(PHYAD1(RXD1_0))
ETH_RX1: IC18.117(-TILE1:X1D31) IC24.44(PHYAD2(RXD1_1))
ETH_RX2: IC18.118(-TILE1:X1D32) IC24.45(PHYAD3(RXD1_2))
ETH_RX3: IC18.119(-TILE1:X1D33) IC24.46(PHYAD4(RXD1_3))
ETH_RX_CLK: IC18.114(-TILE1:X1D28) IC24.38(RX_CLK)
ETH_RX_CTL: IC18.115(-TILE1:X1D29) IC24.39(MII_MODE(RX_DV))
ETH_RX_ER: IC18.15(-TILE1:X1D36) IC24.41(MDIX_EN(RX_ER))
ETH_TX0: IC18.109(-TILE1:X1D43) IC24.3(TXD_0)
ETH_TX1: IC18.108(-TILE1:X1D42) IC24.4(TXD_1)
ETH_TX2: IC18.107(-TILE1:X1D41) IC24.5(TXD_2)
ETH_TX3: IC18.106(-TILE1:X1D40) IC24.6(TXD_3/SNI_MODE)
ETH_TX_CLK: IC24.1(TX_CLK) R42.2
ETH_TX_CTL: IC18.113(-TILE1:X1D27) IC24.2(TX_EN)
GND [gnd]: C58.1 C59.2 C60.2 C61.2 C63.1 C64.1 C65.2 C66.1 C67.2 C68.1 C69.2 C70.2 C71.- C72.2 C73.2 C74.2 C75.2 IC22.3(B:VSS) IC23.7(GND) IC23.TP IC24.15(AGND-15) IC24.19(AGND-19) IC24.35(IOGND-35) IC24.36(DGND) IC24.47(IOGND-47) IC24.PAD(GND) R37.2 R51.1 R52.1 R53.1 X7.4(SH) X7.5(SH) X7.SH1(SH) X7.SH2(SH) XO2.2(GND) ; supply symbol labelled PGND ; also sheet 1,2,3,5
LED_ACT: IC24.26(AN_EN(LED_ACT/COL)) R43.2 R49.2
LED_LINK: IC24.28(AN_0(LED_LINK)) R48.2 R50.2
LED_SPEED: IC24.27(AN_1(LED_SPEED)) R46.2 SPEED.C
N$9: IC18.112(-TILE1:X1D26) R42.1
N$13: IC24.34(X1) R39.2
N$16: R49.1 X7.11(YELLOW-C)
N$19: R50.1 X7.10(GREEN-C)
N$34: R39.1 XO2.3(OUT)
N$56: IC23.5(VO+) R38.1 SP1.+ X6.2
N$97: IC24.24(RBIAS) R53.2
N$98: IC24.21(RESERVED-21) R51.2
N$99: IC24.20(RESERVED-20) R52.2
N$101: R45.2 SPEED.A
N$102: C67.1 R44.1 R47.2
N$103: C65.1 R40.1 R41.2
N$166: IC23.8(VO-) R32.1 SP1.- X6.1
N$171: IC23.4(IN-) R36.1 R38.2
N$181: IC23.3(IN+) R32.2 R35.1
N$193: C59.1 R35.2
N$194: C64.2 IC23.2(BYPASS)
N$195: C62.1 R36.2
N$197: C62.2 R34.1
N$198: C61.1 R33.1 R34.2
N$199: C60.1 IC22.4(A:Y) R33.2
PFBOUT: C69.1 C70.1 C71.+ C72.1 IC24.18(PFBIN1) IC24.23(PFBOUT) IC24.37(PFBIN2)
RD+: IC24.14(RD+) R44.2 X7.7(RD+)
RD-: IC24.13(RD-) R47.1 X7.8(RD-)
SPI_INT: IC18.13(-TILE1:X1D35) ; also sheet 5
TD+: IC24.17(TD+) R40.2 X7.1(TD+)
TD-: IC24.16(TD-) R41.1 X7.2(TD-)
Unconnected: IC18.20(-TILE1:X1D38) IC18.21(-TILE1:X1D39) IC18.22(-TILE1:X1D16) IC18.23(-TILE1:X1D17) IC18.25(-TILE1:X1D18) IC18.26(-TILE1:X1D19) IC18.51(-TILE1:X1D14) IC18.53(-TILE1:X1D15) IC18.54(-TILE1:X1D20) IC18.55(-TILE1:X1D21) IC18.72(-TILE1:X1D02) IC18.74(-TILE1:X1D03) IC18.75(-TILE1:X1D04) IC18.76(-TILE1:X1D05) IC18.77(-TILE1:X1D06) IC18.79(-TILE1:X1D07) IC18.82(-TILE1:X1D08) IC18.84(-TILE1:X1D09) IC18.85(-TILE1:X1D00) IC18.86(-TILE1:X1D01) IC24.7(PWR_DOWN/INT) IC24.8(TCK) IC24.9(TDO) IC24.10(TMS) IC24.11(!TRST) IC24.12(TDI) IC24.25(CLK_OUT) IC24.33(X2) IC24.40(CRS/CRS_DV/LED_CFG) IC24.42(PHYAD0(COL)) XO2.1(EN)

### Notes on the sheet
- W O R K I N G   D R A F T
- MCU Tile1 & Ethernet PHY | Audio amplifier
- Consumption: +3.3 V, max. 2 mA
- Tant.
- MCU Tile 1, Ethernet PHY, Audio amplifier
- Consumption: +3.3 V, typ. 92 mA
- Licensed under the TAPR Open Hardware License (www.tapr.org/OHL)
- More info at http://www.envox.hr/eez
- Repository: https://github.com/eez-open

## Sheet 5 of 5
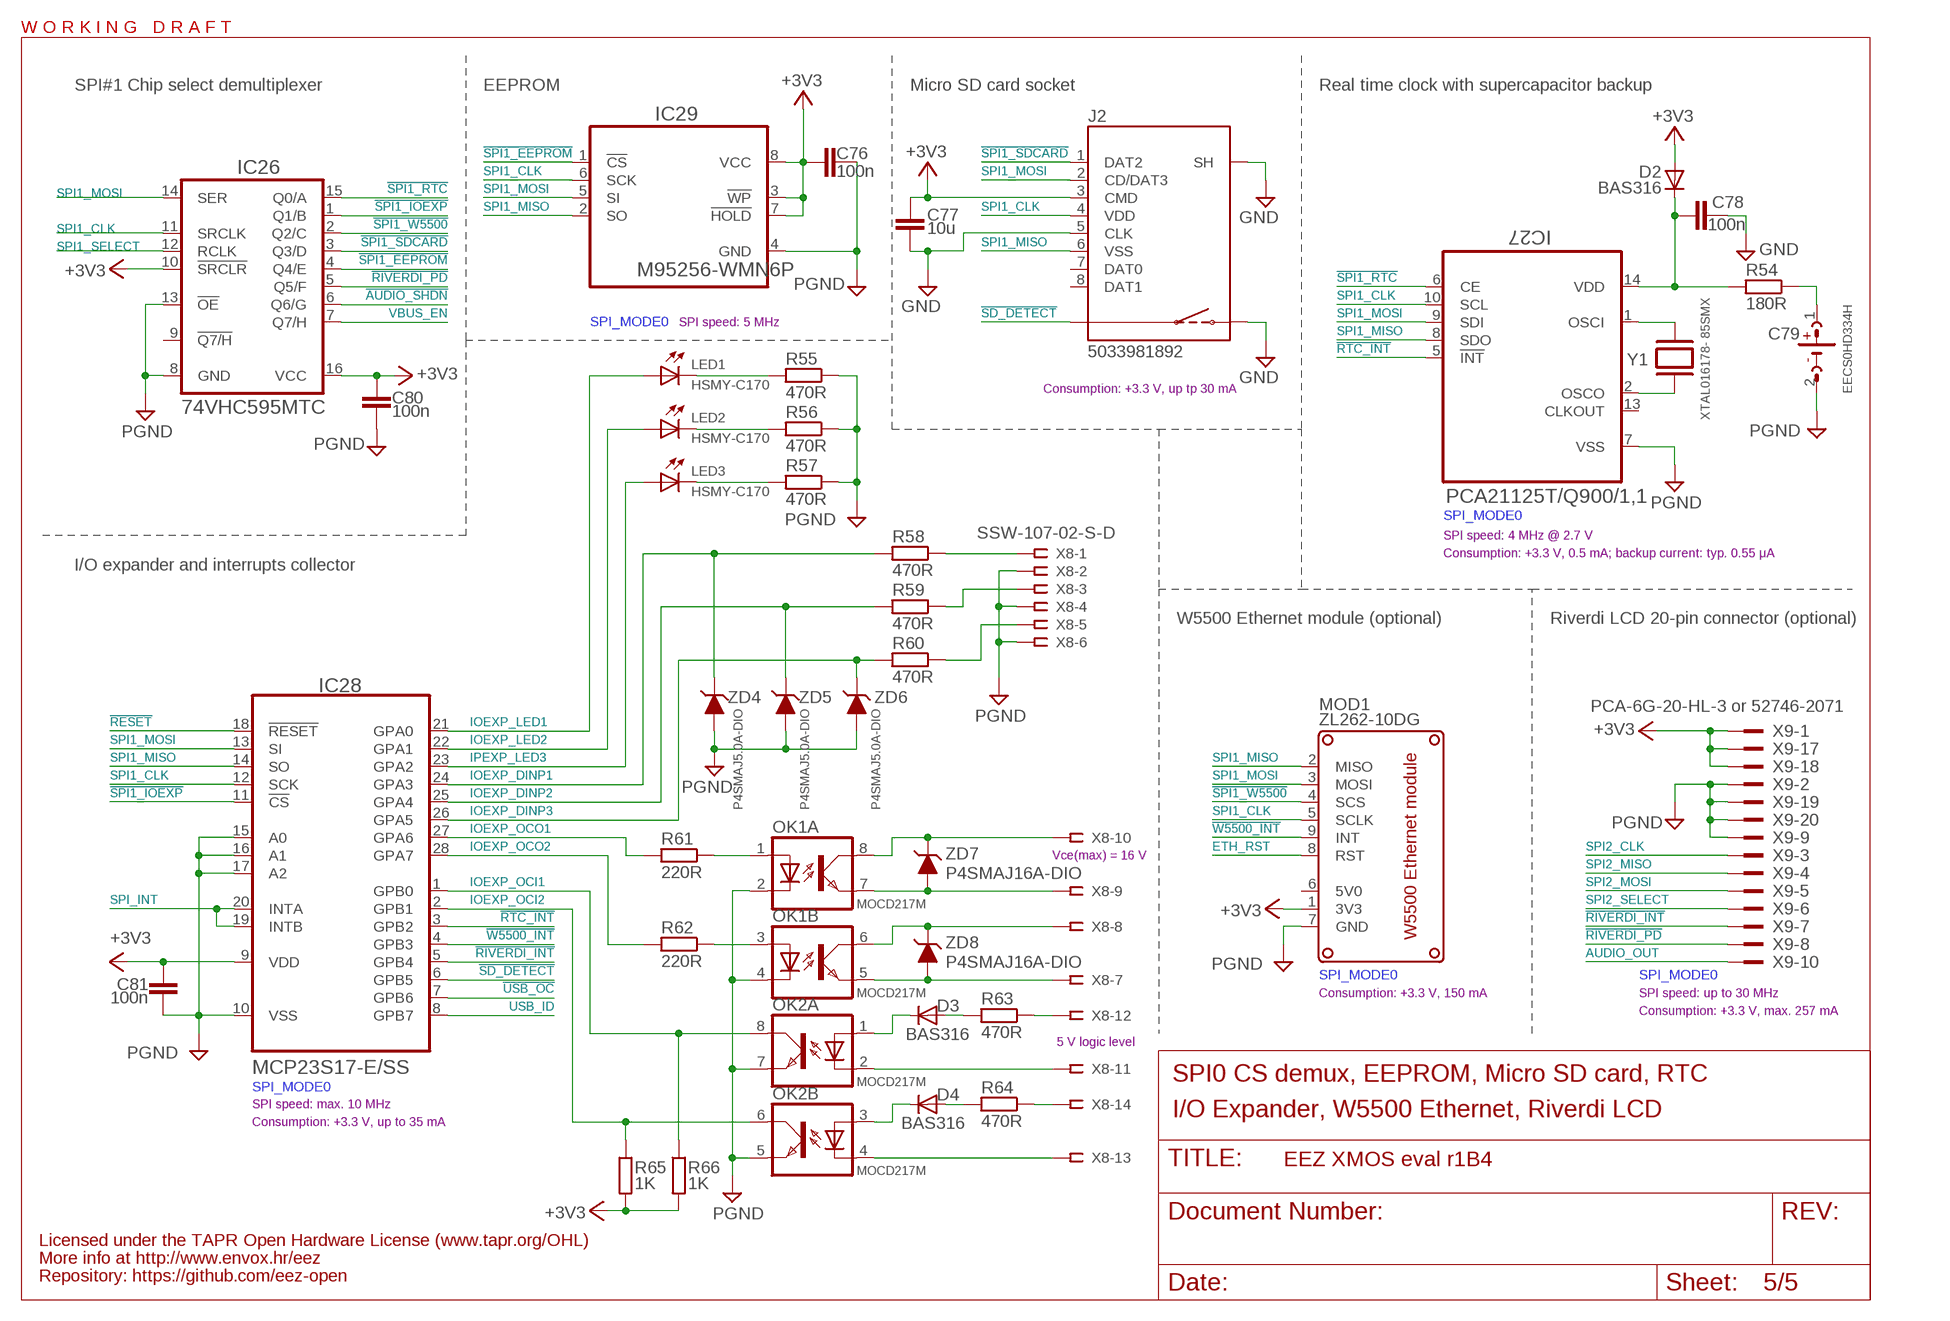
[diagram p4: schematic, sheet 5]

### Parts
C76  100n  C-EUC0603  [C0603]
C77  10u  C-EUC1210  [C1210]
C78  100n  C-EUC0603  [C0603]
C79  EECS0HD334H  SUPER_CAP-10  [SG-R10MM]
C80  100n  C-EUC0603  [C0603]
C81  100n  C-EUC0603  [C0603]
D2  BAS316  DIODE-SOD323-W  [SOD323-W]
D3  BAS316  DIODE-SOD323-W  [SOD323-W]
D4  BAS316  DIODE-SOD323-W  [SOD323-W]
IC26  74VHC595MTC  SN74HC595TSSOP  [PW(R-PDSO-G16)]
IC27  PCA21125T/Q900/1,1  PCA21125TSSOP-14  [SOP65P640X120-14N]
IC28  MCP23S17-E/SS  [SOP65P780X200-28N]
IC29  M95256-WMN6P  AT25XXXSOIC8  [SOIC127P600X175-8N]
J2  5033981892  [5033981892]
LED1  HSMY-C170  LED0805  [LED_0805]
LED2  HSMY-C170  LED0805  [LED_0805]
LED3  HSMY-C170  LED0805  [LED_0805]
MOD1  ZL262-10DG  ETH_W5500_MODULE  [ETH_W5500_MODULE]
OK1  MOCD217M  MOCD217  [SO8-OPTO]
OK2  MOCD217M  MOCD217  [SO8-OPTO]
R54  180R  R-EU_R0805  [R0805]
R55  470R  R-EU_R0805  [R0805]
R56  470R  R-EU_R0805  [R0805]
R57  470R  R-EU_R0805  [R0805]
R58  470R  R-EU_R0805  [R0805]
R59  470R  R-EU_R0805  [R0805]
R60  470R  R-EU_R0805  [R0805]
R61  220R  R-EU_R0805  [R0805]
R62  220R  R-EU_R0805  [R0805]
R63  470R  R-EU_R0805  [R0805]
R64  470R  R-EU_R0805  [R0805]
R65  1K  R-EU_R0805  [R0805]
R66  1K  R-EU_R0805  [R0805]
X8  SSW-107-02-S-D  [SSW-107-02-S-D]
X9  PCA-6G-20-HL-3 or 52746-2071  WR-FPC_68712014522_ROTATED  [FPC-20_ROTATED]
Y1  XTAL016178- 85SMX  XTAL85SMX  [85SMX]
ZD4  P4SMAJ5.0A-DIO  PSMAXX  [DO214AC]
ZD5  P4SMAJ5.0A-DIO  PSMAXX  [DO214AC]
ZD6  P4SMAJ5.0A-DIO  PSMAXX  [DO214AC]
ZD7  P4SMAJ16A-DIO  PSMAXX  [DO214AC]
ZD8  P4SMAJ16A-DIO  PSMAXX  [DO214AC]

### Nets
!AUDIO_SHDN: IC26.6(Q6/G) ; also sheet 4
!RESET: IC28.18(!RESET) ; also sheet 1,2,3
!RIVERDI_INT: IC28.5(GPB4) X9.7
!RIVERDI_PD: IC26.5(Q5/F) X9.8
!RTC_INT: IC27.5(!INT) IC28.3(GPB2)
!SD_DETECT: IC28.6(GPB5) J2.SW1
!SPI1_EEPROM: IC26.4(Q4/E) IC29.1(!CS)
!SPI1_IOEXP: IC26.1(Q1/B) IC28.11(!CS)
!SPI1_RTC: IC26.15(Q0/A) IC27.6(CE)
!SPI1_SDCARD: IC26.3(Q3/D) J2.1(DAT2)
!SPI1_W5500: IC26.2(Q2/C) MOD1.4(SCS)
!USB_OC: IC28.7(GPB6) ; also sheet 3
!W5500_INT: IC28.4(GPB3) MOD1.9(INT)
+3V3: C76.1 C77.1 C80.2 C81.1 D2.A IC26.10(!SRCLR) IC26.16(VCC) IC28.9(VDD) IC29.3(!WP) IC29.7(!HOLD) IC29.8(VCC) J2.3(CMD) MOD1.1(3V3) R65.2 R66.2 X9.1 X9.17 X9.18 ; also sheet 1,2,3,4
AUDIO_OUT: X9.10 ; also sheet 3,4
ETH_RST: MOD1.8(RST) ; also sheet 4
GND [gnd]: C76.2 C77.2 C78.1 C79.2(-) C80.1 C81.2 IC26.8(GND) IC26.13(!OE) IC27.7(VSS) IC28.10(VSS) IC28.15(A0) IC28.16(A1) IC28.17(A2) IC29.4(GND) J2.5(CLK) J2.S(SH) J2.SW2 MOD1.7(GND) OK1.2(A:C) OK1.4(B:C) OK2.5(B:EMIT) OK2.7(A:EMIT) R55.1 R56.1 R57.1 X8.2 X8.4 X8.6 X9.2 X9.9 X9.19 X9.20 ZD4.A ZD5.A ZD6.A ; supply symbol labelled PGND ; also sheet 1,2,3,4
IOEXP_DINP1: IC28.24(GPA3) R58.2 ZD4.C
IOEXP_DINP2: IC28.25(GPA4) R59.2 ZD5.C
IOEXP_DINP3: IC28.26(GPA5) R60.2 ZD6.C
IOEXP_LED1: IC28.21(GPA0) LED1.A
IOEXP_LED2: IC28.22(GPA1) LED2.A
IOEXP_OCI1: IC28.1(GPB0) OK2.8(A:COL) R66.1
IOEXP_OCI2: IC28.2(GPB1) OK2.6(B:COL) R65.1
IOEXP_OCO1: IC28.27(GPA6) R61.2
IOEXP_OCO2: IC28.28(GPA7) R62.2
IPEXP_LED3: IC28.23(GPA2) LED3.A
N$6: OK2.4(B:C) X8.13
N$17: OK1.8(A:COL) X8.10 ZD7.C
N$23: OK1.7(A:EMIT) X8.9 ZD7.A
N$25: OK1.6(B:COL) X8.8 ZD8.C
N$26: OK1.5(B:EMIT) X8.7 ZD8.A
N$27: OK1.1(A:A) R61.1
N$29: D3.C OK2.1(A:A)
N$38: OK2.2(A:C) X8.11
N$39: D3.A R63.2
N$42: IC27.1(OSCI) Y1.1
N$44: D4.A R64.2
N$45: D4.C OK2.3(B:A)
N$47: R64.1 X8.14
N$50: OK1.3(B:A) R62.1
N$51: R63.1 X8.12
N$54: IC27.2(OSCO) Y1.4
N$58: LED1.C R55.2
N$59: LED2.C R56.2
N$60: LED3.C R57.2
N$66: R58.1 X8.1
N$69: R59.1 X8.3
N$70: R60.1 X8.5
N$107: C79.1(+) R54.1
N$109: C78.2 D2.C IC27.14(VDD) R54.2
SPI1_CLK: IC26.11(SRCLK) IC27.10(SCL) IC28.12(SCK) IC29.6(SCK) J2.4(VDD) MOD1.5(SCLK) ; also sheet 1,3
SPI1_MISO: IC27.8(SDO) IC28.14(SO) IC29.2(SO) J2.6(VSS) MOD1.2(MISO) ; also sheet 1,3
SPI1_MOSI: IC26.14(SER) IC27.9(SDI) IC28.13(SI) IC29.5(SI) J2.2(CD/DAT3) MOD1.3(MOSI) ; also sheet 1,3
SPI1_SELECT: IC26.12(RCLK) ; also sheet 3
SPI2_CLK: X9.3 ; also sheet 3
SPI2_MISO: X9.4 ; also sheet 3
SPI2_MOSI: X9.5 ; also sheet 3
SPI2_SELECT: X9.6 ; also sheet 3
SPI_INT: IC28.19(INTB) IC28.20(INTA) ; also sheet 4
USB_ID: IC28.8(GPB7) ; also sheet 3
VBUS_EN: IC26.7(Q7/H) ; also sheet 3
Unconnected: IC26.9(!Q7/H) IC27.13(CLKOUT) J2.7(DAT0) J2.8(DAT1) X9.11 X9.12 X9.13 X9.14 X9.15 X9.16

### Notes on the sheet
- W O R K I N G   D R A F T
- SPI#1 Chip select demultiplexer | EEPROM | Micro SD card socket | Real time clock with supercapacitor backup
- SPI_MODE0 | SPI speed: 5 MHz
- Consumption: +3.3 V, up tp 30 mA
- SPI_MODE0
- SPI speed: 4 MHz @ 2.7 V
- Consumption: +3.3 V, 0.5 mA; backup current: typ. 0.55 μA
- I/O expander and interrupts collector
- W5500 Ethernet module (optional) | Riverdi LCD 20-pin connector (optional)
- Vce(max) = 16 V
- SPI_MODE0 | SPI_MODE0
- Consumption: +3.3 V, 150 mA | SPI speed: up to 30 MHz
- Consumption: +3.3 V, max. 257 mA
- 5 V logic level
- SPI0 CS demux, EEPROM, Micro SD card, RTC
- SPI_MODE0
- SPI speed: max. 10 MHz
- I/O Expander, W5500 Ethernet, Riverdi LCD
- Consumption: +3.3 V, up to 35 mA
- Licensed under the TAPR Open Hardware License (www.tapr.org/OHL)
- More info at http://www.envox.hr/eez
- Repository: https://github.com/eez-open

## Power pins joined to a net without a drawn wire
3: X1.3
5V0: MOD1.6(5V0)

## Library data of the parts
C1-C3 C6 C7 C10-C39 C42-C70 C72-C78 C80 C81 = rcl:C-EU: CAPACITOR, European symbol
C4 C5 C8 C9 C40 C41 = Panasonic-EEEFK_EEEFP:EEE-: Aluminum Electrolytic Capacitors,Surface Mount Type; MPN: EEE-FK1V100R; OC_FARNELL: 1850112; OC_NEWARK: 23T0867; PACKAGE: CASE-C; SUPPLIER: PANASONIC; TOLERANCE: ±20 %; VALUE: 10UF; VOLTAGERATING: 35V
C71 = EEZ_Lib1:ECAP
C79 = EEZ_Lib1:SUPER_CAP: Electric Double Layer Supercapacitors, Type EDL Vertical - Manufacturer Part No: EDLSG105V5R5C Farnell: 2113011 Horizontal - Manufacturer Part No: EDLSG105H5R5C Farnell: 1364209, 9697497
D1 = EEZ_Lib1:SCHOTTKY
D2-D4 = diode:DIODE-: DIODE
F1 = EEZ_Lib1:FUSE_RESETTABLE2
FB1-FB3 = EEZ_Lib1:FERRITE_BEAD: FAIR-RITE - 2506033007Y3 - FERRITE BEAD, 0.04OHM, 3A, 0603 Farnell: 2112873
FM1 FM2 = EEZ_Lib1:FIDUCIAL: Fiducial mark for pick and place automation
IC1 = EEZ_Lib1:TPS61169DCKR: 38-V High Current-Boost WLED Driver with PWM Control; MANUFACTURER: Texas Instruments; PARTNUMBER: TPS61169DCKR; REFDES: RefDes; TYPE: TYPE; VALUE: Value
IC2 IC4 IC17 = EEZ_Lib1:TPS56120X: 4.5-V to 17-V Input, 1-A Synchronous Step-Down Voltage Regulator in 6-Pin SOT-23
IC3 IC5 IC26 = EEZ_Lib1:SN74HC595: 8-Bit Shift Register with Output Latches
IC6 IC8 = EEZ_Lib1:TPS3808: Low-Quiescent-Current, Programmable-Delay Supervisory Circuit; DATASHEETURL: httpwww.ti.comlitgpnTPS3808G01; FAMILY_NAME: SUPERVISOR AND RESET IC; GENERIC_PART_NUMBER: TPS3808G01; INDUSTRY_STD_PKG_TYPE: SOT23; MANUFACTURER: Texas Instruments; MANUFACTURER_PART_NUMBER: tps3808g01_dbv_6; PACKAGE_DESIGNATOR: DBV; PIN_COUNT: 6; VENDOR: Texas Instruments
IC7 = EEZ_Lib1:AR1021-I/SS: AR1000 series resistive touch screen controller; I2C/SPI
IC9 = EEZ_Lib1:SN74LVC1G74DCTR: Single Positive-Edge-Triggered D-Type Flip-Flop with Clear and Preset
IC10 = EEZ_Lib1:IS42S16400: 1 MBits x 16 Bits x 4 Banks (64-Mbit) Synchronous Dynamic RAM
IC11 IC14 = EEZ_Lib1:SN74CBTLV3257: Quad 1-of-2 multiplexer/demultiplexer
IC12 = EEZ_Lib1:SN74LVC1G02DBVR: Single 2-Input Positive NOR-Gate
IC13 = EEZ_Lib1:AT25SFXXX: SPI Serial Flash Memory with Dual-I/O and Quad-I/O Support
IC15 = EEZ_Lib1:TPS2051B: Current-Limited, Power-Distribution Switch (pos. enable input)
IC16 = EEZ_Lib1:TPD2E001: Low-Capacitance 2-Channel +/-15 kV ESD-Protection Array for High-Speed Data Interfaces
IC18 = EEZ_xmos:XE216-TQ128: XMOS Multicore Microcontroller with Advanced Multi-Core RISC Architecture, Etnernet, USB, 128 pins
IC19 IC20 = EEZ_Lib1:TPD4E001: Low-Capacitance 4-Channel ESD-Protection for High-Speed Data Interfaces
IC21 IC22 = EEZ_Lib1:SN74LVC1G07: Single Buffer/Driver With Open-Drain Output
IC23 = EEZ_Lib1:TPA6205: 1.25-W Mono Fully Differential Audio Power Amplifier
IC24 = EEZ_Lib1:DP83848: DP83848C/I/VYB/YB PHYTER™ QFP Single Port 10/100 Mb/s Ethernet Physical Layer Transceiver
IC27 = EEZ_Lib1:PCA21125: SPI-bus Real-Time Clock and calendar Farnell: 2400445
IC28 = EEZ_Lib1:MCP23S17-E/SS: 16-Bit I/O Expander with Serial Interface; FARNELL: 1467675; TME: MCP23S17-E/SS
IC29 = EEZ_Lib1:AT25XXX: SPI Serial EEPROM, Supports SPI Modes 0 (0,0) and 3 (1,1) Atmel AT25128 128K (16 384 x 8) Farnell: 2345601 Atmel AT25256 256K (32 768 x 8) Farnell: 1841577 Atmel AT25512 512K (65 536 x 8) Farnell: 2345608
J1 = EEZ_Lib1:678038020: USB AB mini socket; SMT; PIN:5; horizontal; gold plated
J2 = EEZ_Lib1:5033981892: SD Micro connector; push-push; SMT; gold plated
L1-L4 = EEZ_Lib1:DE0403: Ferrocore SMD power coil 4.0 x 4.5 mm
LCD1 = EEZ_Lib1:RFE430Y-AIW-DNS: 40-pin socket for TFT LCD display with touchscreen
LED1-LED3 PWR_3V3 SPEED = EEZ_Lib1:LED
MOD1 = EEZ_Lib1:ETH_W5500_MODULE: W5500 Ethernet module with SPI (55 x 28 mm)
OK1 OK2 = EEZ_Lib1:MOCD217: Dual-channel phototransistor output opto-coupler
Q1 = EEZ_Lib1:IRLML2246TRPBF: HEXFET Power MOSFET (-20V, -2.6A); MPN: IRLML2246TRPBF; OC_FARNELL: 1888166; OC_NEWARK: 40T7450; PACKAGE: SOT-3; SUPPLIER: International Rectifier; TME: IRLML2246TRPBF
R1-R67 = rcl:R-EU_: RESISTOR, European symbol
SP1 = EEZ_Lib1:BUZZER: Loudity LD-BZEN-xxxx Sound transducer: electromagnetic; without built-in generator
SW1 = EEZ_Lib1:TACT_SW
X1 = EEZ_Lib1:DC21_PWR
X2 = con-samtec:SSW-105-02-S-D: THROUGH-HOLE .025" SQ POST SOCKET Source: Samtec SSW.pdf; MPN: SSW-105-02-S-D; OC_FARNELL: unknown; OC_NEWARK: 11P9398
X3 = EEZ_Lib1:TSW-104-02-S-D: THROUGH-HOLE .025" SQ POST HEADER Source: Samtec TSW.pdf
X4 = EEZ_Lib1:TSW-103-07-F-D: Samtec TSW-103-07-F-D Header, 2.54MM, THT, 6-way; FARNELL: 2025171
X5 = con-harting-ml:ML20: HARTING; OC_FARNELL: unknown; OC_NEWARK: unknown
X6 = con-molex:22-23-2021: .100" (2.54mm) Center Header - 2 Pin; MF: MOLEX; MPN: 22-23-2021; OC_FARNELL: 1462926; OC_NEWARK: 25C3832
X7 = EEZ_Lib1:RJ45-TRAFO-LED: AMPHENOL LMJTAB881243M-L Socket; RJ45; PIN:8; shielded, with LED and trafo; TME: LMJTAB881243M-L
X8 = con-samtec:SSW-107-02-S-D: THROUGH-HOLE .025" SQ POST SOCKET Source: Samtec SSW.pdf; MPN: SSW-107-02-S-D; OC_FARNELL: unknown; OC_NEWARK: 11P9431
X9 = EEZ_Lib1:WR-FPC_68712014522: 20-pin 0.5mm SMT ZIF Horizontal Bottom Contact WR-FPC
XO1 XO2 = EEZ_Lib1:XO
Y1 = EEZ_Lib1:XTAL
ZD1 ZD2 = EEZ_Lib1:ZENER-DIODE
ZD3-ZD8 = EEZ_Lib1:PSMAXX: Transient Voltage Suppressor, TVS, P4SMA Series, Unidirectional

## Net classes
0 default: width 0.152 mm, drill 0.3 mm, clearance 0.203 mm
1 dgnd: width 0.152 mm, drill 0.3 mm, clearance 0.203 mm
2 gnd: width 0.152 mm, drill 0.3 mm, clearance 0.203 mm